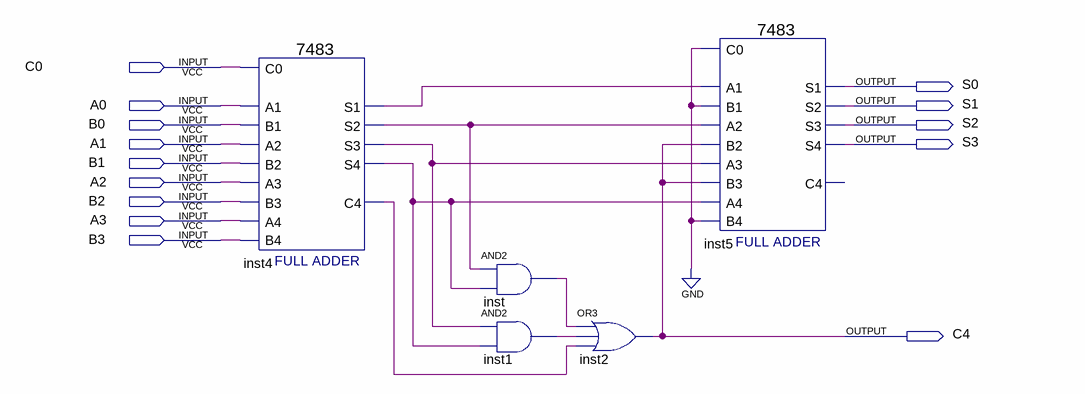
[diagram p0: schematic sheet]
// Quartus schematic BCD_adder_G_7483.bdf as structural Verilog: 5 symbols, 14 pins
module BCD_adder_G_7483 (
  input  C0,
  input  A0,
  input  B0,
  input  A1,
  input  B1,
  input  A2,
  input  B2,
  input  A3,
  input  B3,
  output S0,
  output S1,
  output S2,
  output S3,
  output C4
);

  wire inst1_out, inst4_c4, inst4_s1, inst4_s2, inst4_s3, inst4_s4, inst_out;

  \7483  inst4 (
    .B4(B3), .C0(C0), .A1(A0), .A2(A1), .B1(B0), .B2(B1), .A3(A2), .B3(B2), .A4(A3), .S3(inst4_s3),
    .S4(inst4_s4), .S2(inst4_s2), .C4(inst4_c4), .S1(inst4_s1));
  and inst (inst_out, inst4_s2, inst4_s4);
  and inst1 (inst1_out, inst4_s3, inst4_s4);
  or inst2 (C4, inst_out, inst1_out, inst4_c4);
  \7483  inst5 (
    .B4(1'b0), .C0(1'b0), .A1(inst4_s1), .A2(inst4_s2), .B1(1'b0), .B2(C4), .A3(inst4_s3), .B3(C4),
    .A4(inst4_s4), .S3(S2), .S4(S3), .S2(S1), .S1(S0));  // open: C4
endmodule
